# Altium project Kouspace_Ana_Aviyonik.PrjPcb
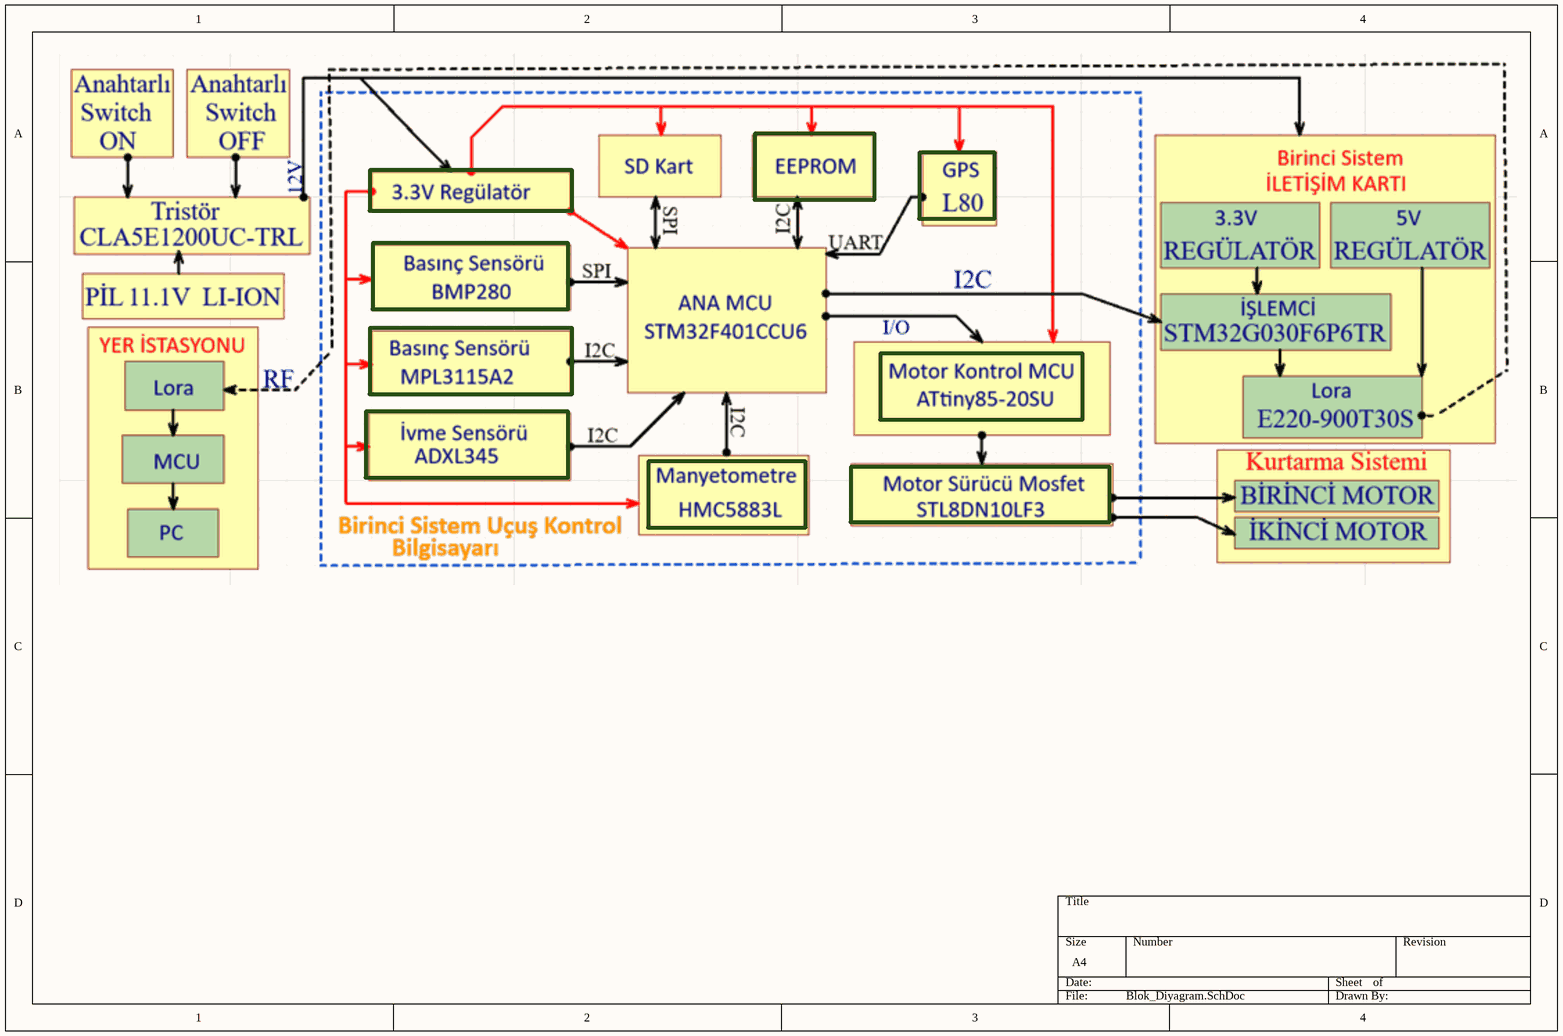
[diagram p0: Blok_Diyagram.SchDoc]
5 sheets, 85 parts. Net scope: global (net labels, ports and power ports of the same name join across sheets).
Board file: PCB.PcbDoc
Sheets:
  Blok_Diyagram.SchDoc
  Power.SchDoc
  Sensor.SchDoc
  Motor_Kontrol.SchDoc
  İşlemci.SchDoc

## Sheet Blok_Diyagram.SchDoc
size A4; SheetNumber: 1; SheetTotal: 4

## Sheet Power.SchDoc
size A4; SheetNumber: 2; SheetTotal: 4
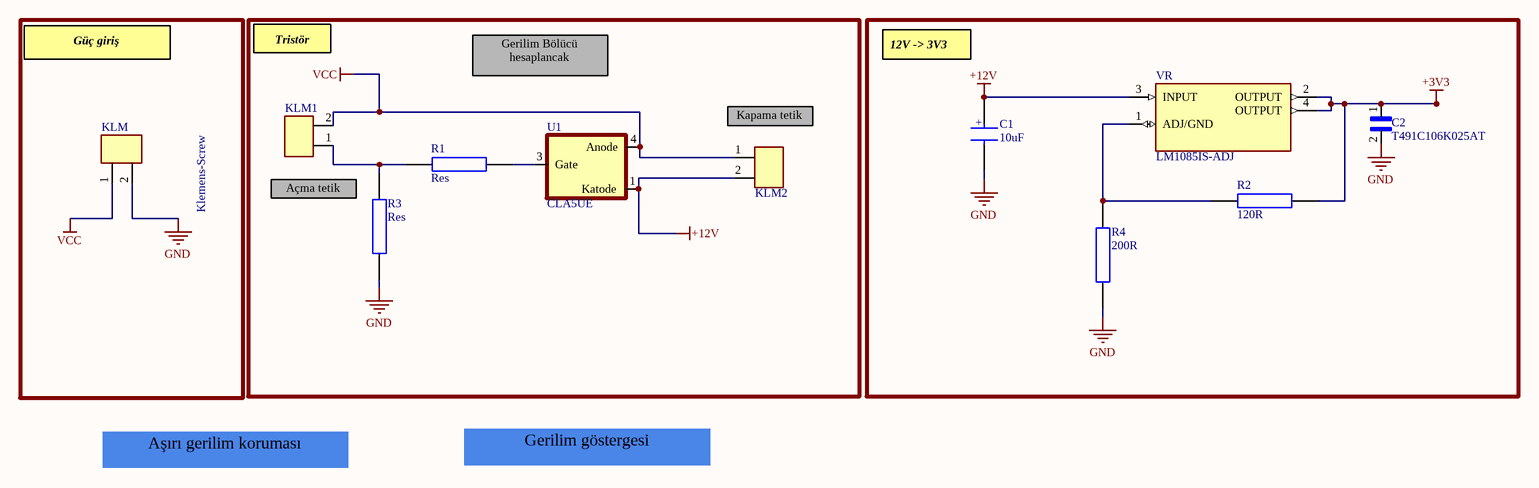
[diagram p1: Power.SchDoc]

### Parts
C1  10uF  [CAP_805]
C2  T491C106K025AT  [CAPPC6032X280N]
KLM  Klemens-Screw  [Klemens-ScrewMount]
KLM1  Klemens-Screw  [Klemens-ScrewMount]  (value not drawn)
KLM2  Klemens-Screw  [Klemens-ScrewMount]  (value not drawn)
R1  Res  [RES_1206]
R2  120R  [RES_1206]
R3  Res  [RES_1206]
R4  200R  [RES_1206]
U1  CLA5UE  [DPAK229P990X239-4N]
VR  LM1085IS-ADJ  [TO254P1524X483-4N]

### Nets
+3V3: C2.1 R2.1 VR.2(OUTPUT) VR.4(OUTPUT)
+12V: C1.1 KLM2.2 U1.1(Katode) VR.3(INPUT)
GND: C1.2 C2.2 KLM.2 R3.1 R4.1
VCC: KLM.1 KLM1.2 KLM2.1 U1.4(Anode)
NetKLM1_1: KLM1.1 R1.2 R3.2
NetR1_1: R1.1 U1.3(Gate)
NetR2_2: R2.2 R4.2 VR.1(ADJ/GND)

### Notes on the sheet
- Güç giriş
- Tristör
- Gerilim Bölücü hesaplancak
- 12V -> 3V3
- (near KLM2) Kapama tetik
- Açma tetik
- Aşırı gerilim koruması
- Gerilim göstergesi
- (in symbol CAP 1uF) +

### Library data of the parts
C1 = CAP 1uF: 0805 smd
C2 = T491C106K025AT: 10 ÂµF Molded Tantalum Capacitors 25 V 2312 (6032 Metric) 1.5Ohm; MF: KEMET; Value: *; SnapEDA_Link: https://www.snapeda.com/parts/T491C106K025AT/KEMET/view-part/?ref=snap; Purchase-URL: https://pricing.snapeda.com/search/part/T491C106K025AT/?ref=eda; Availability: In Stock; Price: None; Package: SMD-2 KEMET; Check_prices: https://www.snapeda.com/parts/T491C106K025AT/KEMET/view-part/?ref=eda; MP: T491C106K025AT
R1-R4 = RES 1K 1206
VR = LM1085IS-ADJ: 3-A, 29-V, linear voltage regulator 3-DDPAK/TO-263; MF: Texas Instruments; SnapEDA_Link: https://www.snapeda.com/parts/LM1085IS-ADJ/Texas%20Instruments/view-part/213969/?ref=snap; Price: None; MP: LM1085IS-ADJ; Availability: Unavailable; Mouser-Purchase-URL: https://snapeda.com/shop?store=Mouser&id=213969; Value: *; Arrow_Electronics-Purchase-URL: https://snapeda.com/shop?store=Arrow+Electronics&id=213969; DigiKey-Purchase-URL: https://snapeda.com/shop?store=DigiKey&id=213969; Package: TO-263-3 Texas Instruments
KLM KLM1 KLM2 = Klemens-Screw: ComponentLink1Description: New link; ComponentLink1URL: *

## Sheet Sensor.SchDoc
size A4; SheetNumber: 3; SheetTotal: 4
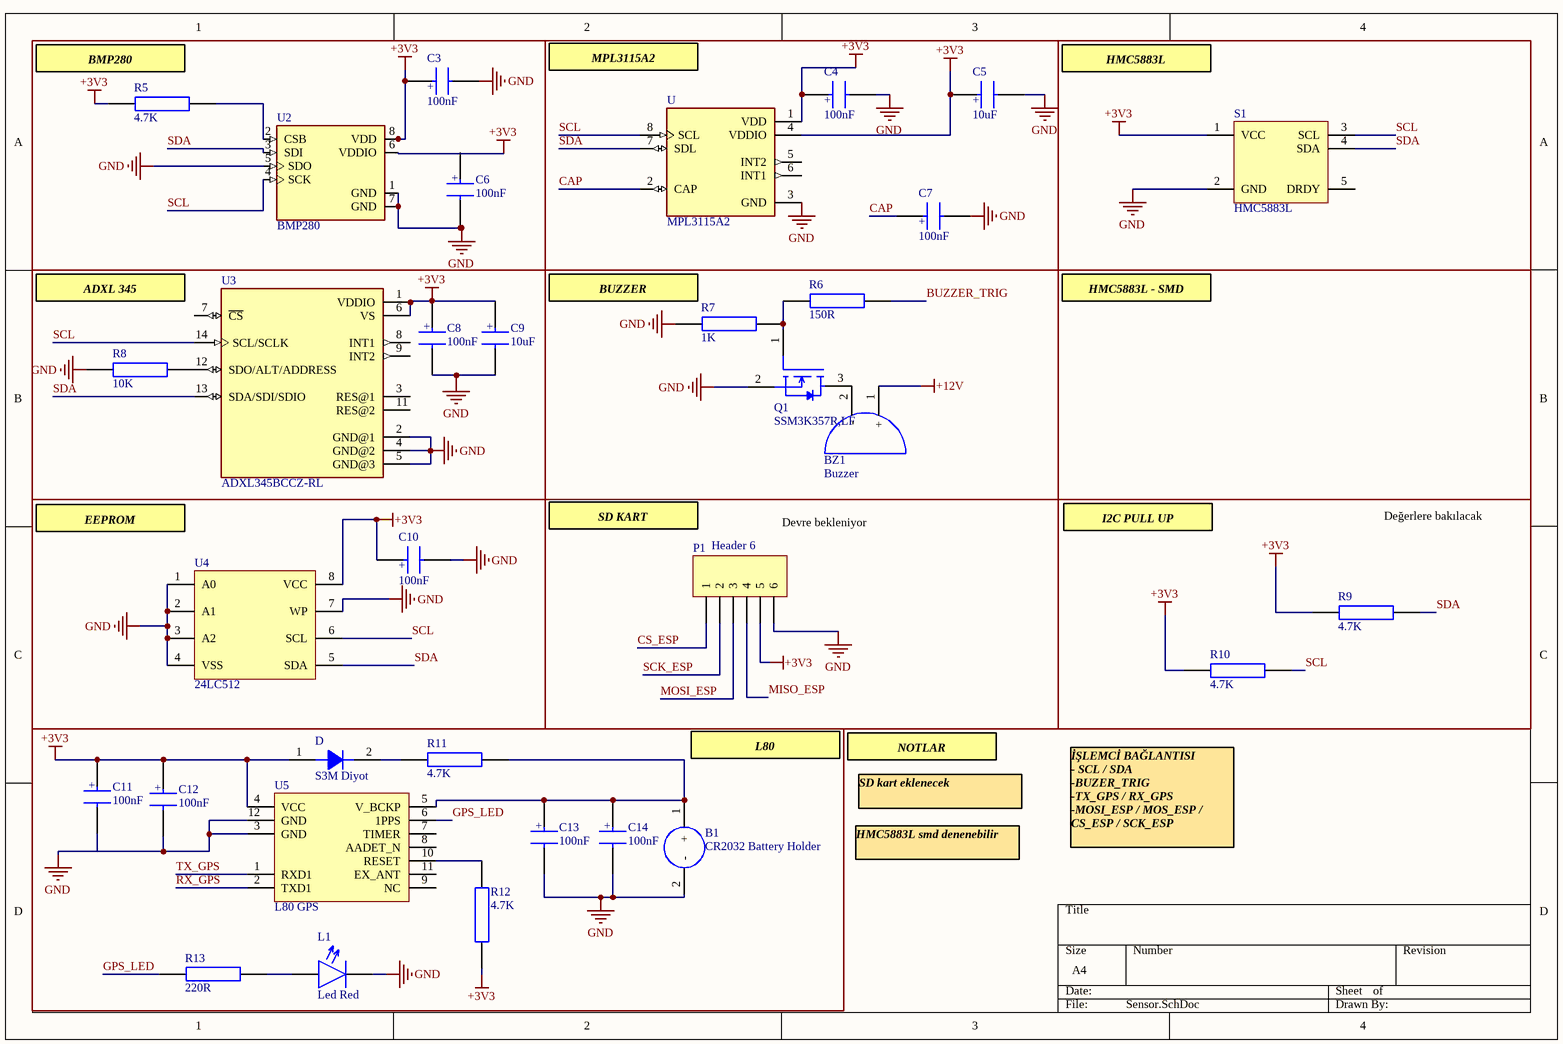
[diagram p2: Sensor.SchDoc]

### Parts
B1  CR2032 Battery Holder  [CR2032]
BZ1  Buzzer  [CMI-9605IC]
C3  100nF  [CAP_805]
C4  100nF  [CAP_805]
C5  10uF  [CAP_805]
C6  100nF  [CAP_805]
C7  100nF  [CAP_805]
C8  100nF  [CAP_805]
C9  10uF  [CAP_805]
C10  100nF  [CAP_805]
C11  100nF  [CAP_805]
C12  100nF  [CAP_805]
C13  100nF  [CAP_805]
C14  100nF  [CAP_805]
D  S3M Diyot  [DO214AA]
L1  Led Red  [Led 1206]
P1  Header 6  [HDR1X6]
Q1  SSM3K357R,LF  [SOT-23F]
R5  4.7K  [RES_1206]
R6  150R  [RES_1206]
R7  1K  [RES_1206]
R8  10K  [RES_1206]
R9  4.7K  [RES_1206]
R10  4.7K  [RES_1206]
R11  4.7K  [RES_1206]
R12  4.7K  [RES_1206]
R13  220R  [RES_1206]
S1  HMC5883L  [HMC5883L]
U  MPL3115A2  [PSON125P300X500X120-8N]
U2  BMP280  [XDCR_BMP280]
U3  ADXL345BCCZ-RL  [PQFN80P300X500X79-14N]
U4  24LC512  [soic-8]
U5  L80 GPS  [L-80]

### Nets
+3V3: C3.1 C4.1 C5.1 C8.1 C9.1 C10.1 C11.1 C12.1 D.1 P1.5 R5.1 R9.1 R10.1 R12.2 S1.1(VCC) U.1(VDD) U.4(VDDIO) U2.6(VDDIO) U2.8(VDD) U3.1(VDDIO) U3.6(VS) U4.8(VCC) U5.4(VCC)
+12V: BZ1.1(+)
GND: B1.2(-) C3.2 C4.2 C5.2 C6.2 C7.2 C8.2 C9.2 C10.2 C12.2 C13.2 C14.2 L1.2 P1.6 Q1.2(S) R7.1 R8.1 S1.2(GND) U.3(GND) U2.1(GND) U2.5(SDO) U2.7(GND) U3.2(GND@1) U3.4(GND@2) U3.5(GND@3) U4.1(A0) U4.2(A1) U4.3(A2) U4.4(VSS) U4.7(WP) U5.3(GND) U5.12(GND)
BUZZER_TRIG: R6.2
CAP: C7.1 U.2(CAP)
CS_ESP: P1.1
GPS_LED: R13.1 U5.6(1PPS)
MISO_ESP: P1.4
MOSI_ESP: P1.3
RX_GPS: U5.2(TXD1)
SCK_ESP: P1.2
SCL: R10.2 S1.3(SCL) U.8(SCL) U2.4(SCK) U3.14(SCL/SCLK) U4.6(SCL)
SDA: R9.2 S1.4(SDA) U.7(SDL) U2.3(SDI) U3.13(SDA/SDI/SDIO) U4.5(SDA)
TX_GPS: U5.1(RXD1)
NetB1_1: B1.1(+) C13.1 C14.1 R11.2 U5.5(V_BCKP)
NetBZ1_2: BZ1.2(-) Q1.3(D)
NetD_2: D.2 R11.1
NetL1_1: L1.1 R13.2
NetQ1_1: Q1.1(G) R6.1 R7.2
NetR5_2: R5.2 U2.2(CSB)
NetR8_2: R8.2 U3.12(SDO/ALT/ADDRESS)
NetR12_1: R12.1 U5.10(RESET)

Not connected (* = marked no-connect by the designer): C6 1; C11 2; S1 5(DRDY); U 5(INT2) 6(INT1); U3 3(RES@1) 7(~{CS}) 8(INT1) 9(INT2) 11(RES@2); U5 7(TIMER) 8(AADET_N) 9(NC) 11(EX_ANT)

### Notes on the sheet
- (near R5) BMP280
- (near U) MPL3115A2
- HMC5883L
- (near U3) ADXL 345
- (near R7) BUZZER
- HMC5883L - SMD
- EEPROM
- SD KART
- I2C PULL UP
- Değerlere bakılacak
- Devre bekleniyor
- L80
- NOTLAR
- HMC5883L smd denenebilir
- SD kart eklenecek
- İŞLEMCİ BAĞLANTISI
  - SCL / SDA
  -BUZER_TRIG
  -TX_GPS / RX_GPS
  -MOSI_ESP / MOS_ESP / CS_ESP / SCK_ESP
- (in symbol CAP 1uF) +

### Library data of the parts
B1 = CR2032 Battery Holder: Battery Holder
BZ1 = BUZZER: Designed by: Ahmet Azboy
C3-C14 = CAP 1uF: 0805 smd
D = S3M Diyot: Current: 3A; Voltage: 1000V; Case/Package: DO214AA
P1 = Header 6: Header, 6-Pin; LatestRevisionDate: 17-Jul-2002; LatestRevisionNote: Re-released for DXP Platform.; Publisher: Altium Limited
Q1 = SSM3K357R,LF: Trans MOSFET N-CH Si 60V 0.65A Automotive 3-Pin SOT-23F T/R; Manufacturer: Toshiba; Designed by: Ahmet Azboy; Supplier 1: Mouser; Manufacturer Part Number: SSM3K357R,LF; RoHS: No; Pricing 1: 1=0,41000, 10=0,33600, 50=0,33600, 100=0,22900, 1000=0,12900, 10000=0,10300 (USD); ComponentLink1URL: https://toshiba.semicon-storage.com/info/docget.jsp?did=59207&prodName=SSM3K357R&src-supplier=Digi-Key; ComponentLink1Description: https://toshiba.semicon-storage.com/info/docget.jsp?did=59207&prodName=SSM3K357R&src-supplier=Digi-Key; Supplier Part Number 1: 757-SSM3K357RLF; Case/Package: SOT23F
R5-R13 = RES 1K 1206
S1 = HMC5883L: Üç Eksenli Manyometre sensörü
U = MPL3115A2: Pressure Sensor 7.25PSI ~ 15.95PSI _50kPa ~ 110kPa_ Absolute 24 b 8-TLGA; MF: NXP USA; SnapEDA_Link: https://www.snapeda.com/parts/MPL3115A2/NXP%20USA%20Inc./view-part/472433/?ref=snap; Availability: Unavailable; MP: MPL3115A2; Price: None; Package: LGA-8 NXP USA; Value: *
U2 = BMP280: BMP280 Absolute Barometric Pressure Sensor for Battery Powered Devices 2 x 2.5mm; Package: None; Availability: Unavailable; MP: BMP280; Value: *; Price: None
U3 = ADXL345BCCZ-RL: Accelerometer X, Y, Z Axis Â±2g, 4g, 8g, 16g 0.05Hz ~ 1.6kHz 14-LGA (3x5); MF: Analog Devices; Check_prices: https://www.snapeda.com/parts/ADXL345BCCZ-RL/Analog%20Devices%20Inc./view-part/52306/?ref=eda; Value: *; Package: LGA -14 Analog Devices; Price: None; MP: ADXL345BCCZ-RL; Purchase-URL: https://pricing.snapeda.com/search/part/ADXL345BCCZ-RL/?ref=eda; SnapEDA_Link: https://www.snapeda.com/parts/ADXL345BCCZ-RL/Analog%20Devices%20Inc./view-part/52306/?ref=snap; Availability: Warning
U4 = 24LC512: EEPROM Serial-2Wire 512K-bit 64K x 8 3.3V/5V 8-Pin SOIJ Tube / IC EEPROM 512KBIT 400KHZ 8SOIJ; Manufacturer: Microchip; Manufacturer Part Number: 24LC512-I/SM; Access Time: 900ns; Memory Size: 512Kb; Nominal Supply Current: 5mA; Interface: I2C,Serial,2-Wire; Max Supply Voltage: 5.5V; Min Supply Voltage: 2.5V; Organization: 64KX8; Write Protection: YES; Write Cycle Time-Max (tWC): 5ms; Designed by: Ahmet Azboy; Supplier 1: RSComponents; RoHS: Yes; Category: EEPROM; Stock 1: 53; Pricing 1: 90=1,48900 (GBP); Mount: Surface Mount; Case/Package: SOIC; Number of Pins: 8; Min Operating Temperature: -40°C; Max Operating Temperature: 85°C; Packaging: Rail/Tube; Frequency: 400kHz; Density: 512Kb; Package Quantity: 90; Memory Type: EEPROM; Max Frequency: 400kHz; Access Time-Max: 900ns; Supply Current: 5mA; Programming Voltage: 5.5V; Supply Voltage-Nom: 5.5V; Length: 5.21mm; Width: 5.28mm; Height: 1.88mm; Radiation Hardening: No; Lead Free: Lead Free; RoHS Compliant: Yes; REACH SVHC: No SVHC; ComponentLink1URL: https://datasheet.ciiva.com/26870/24lc512-i-sm-26870738.pdf?src-supplier=IIIC; ComponentLink1Description: https://datasheet.ciiva.com/26870/24lc512-i-sm-26870738.pdf?src-supplier=IIIC; ComponentLink2URL: https://datasheet.ciiva.com/29294/160414-da-01-en-eeprom-24lc512-i-sm-microchip-29294348.pdf?src-supplier=Conrad; ComponentLink2Description: https://datasheet.ciiva.com/29294/160414-da-01-en-eeprom-24lc512-i-sm-microchip-29294348.pdf?src-supplier=Conrad; ComponentLink3URL: https://datasheet.ciiva.com/17651/21754m-17651369.pdf?src-supplier=Avnet+Europe; ComponentLink3Description: https://datasheet.ciiva.com/17651/21754m-17651369.pdf?src-supplier=Avnet+Europe; ComponentLink4URL: https://datasheet.ciiva.com/1155/1688094-1155274.pdf?src-supplier=Element14; ComponentLink4Description: https://datasheet.ciiva.com/1155/1688094-1155274.pdf?src-supplier=Element14; ComponentLink5URL: https://datasheet.ciiva.com/1155/1688094-1155275.pdf?src-supplier=Element14; ComponentLink5Description: https://datasheet.ciiva.com/1155/1688094-1155275.pdf?src-supplier=Element14; ComponentLink6URL: https://datasheet.ciiva.com/3184/21754m-3184956.pdf?src-supplier=Avnet; ComponentLink6Description: https://datasheet.ciiva.com/3184/21754m-3184956.pdf?src-supplier=Avnet; ComponentLink7URL: https://datasheet.ciiva.com/16921/70045251-16921949.pdf?src-supplier=Allied+Electronics; ComponentLink7Description: https://datasheet.ciiva.com/16921/70045251-16921949.pdf?src-supplier=Allied+Electronics; ComponentLink8URL: https://datasheet.ciiva.com/16304/filehandler-aspxddocname-en546203-16304574.pdf?src-supplier=Future+Electronics; ComponentLink8Description: https://datasheet.ciiva.com/16304/filehandler-aspxddocname-en546203-16304574.pdf?src-supplier=Future+Electronics; Supplier Part Number 1: 8895724
U5 = L80 GPS: Name: Quetcel L80; Designed By: Ahmet Azboy

## Sheet Motor_Kontrol.SchDoc
size A4; SheetNumber: 4; SheetTotal: 5
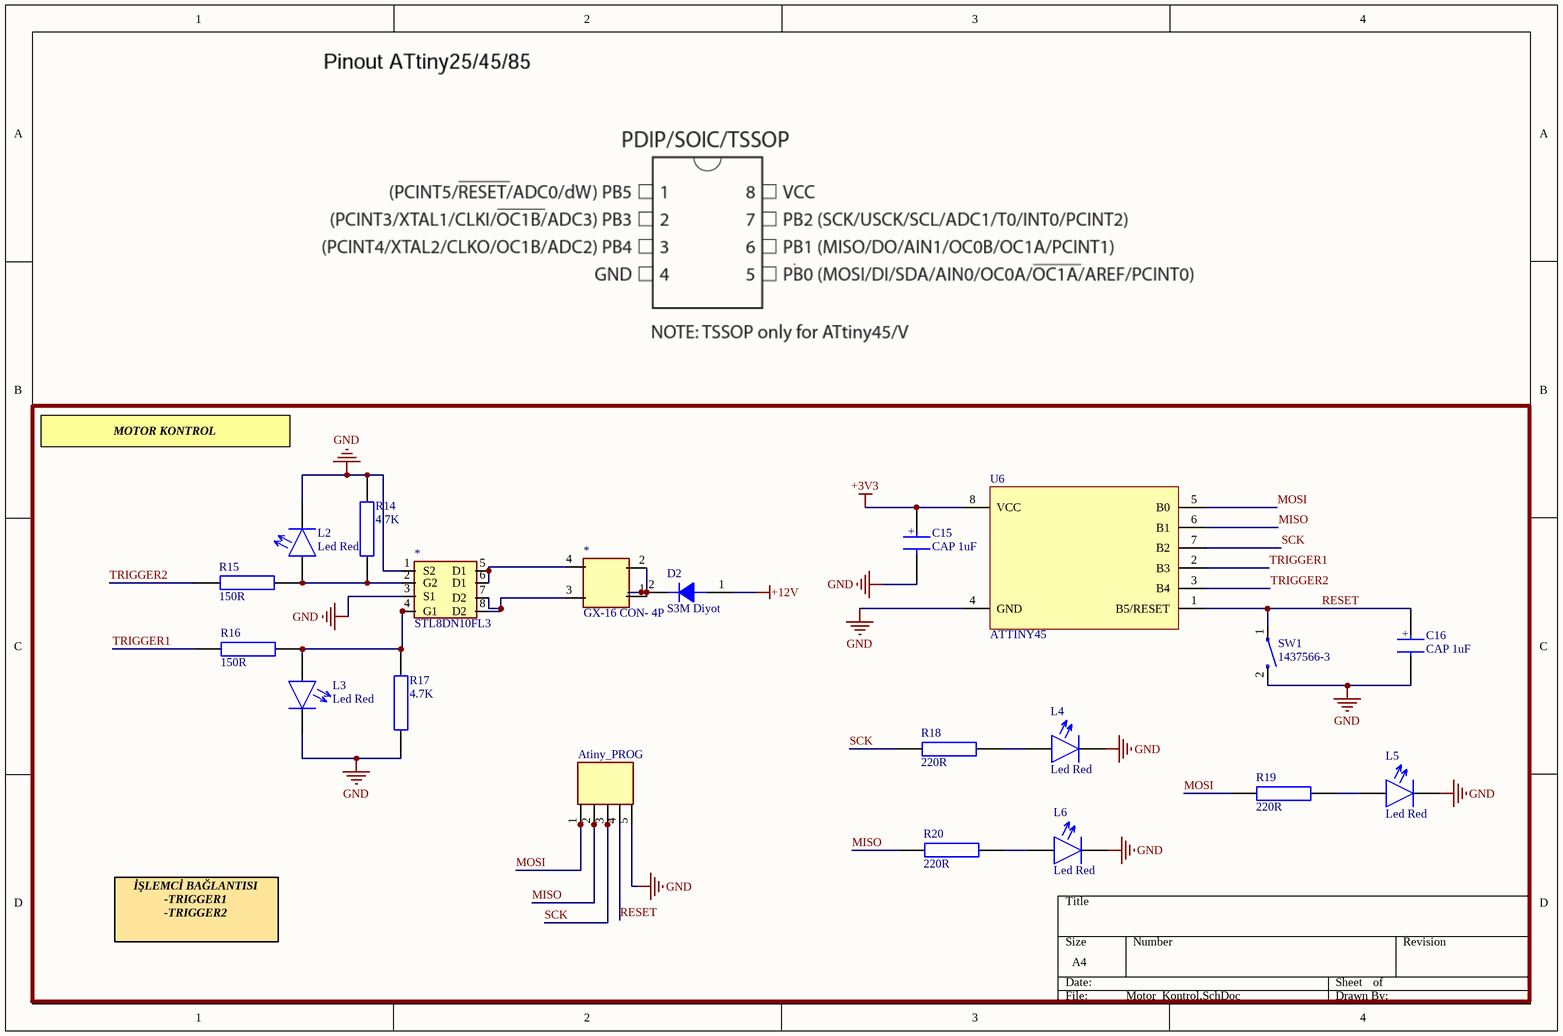
[diagram p3: Motor_Kontrol.SchDoc]

### Parts
(Parts that share a designator on the sheet are numbered #1, #2 ... from top to bottom, then left to right.)
*#1  GX-16 CON- 4P  [GX-16 CON]
*#2  STL8DN10FL3  [TRANS_STL60P4LLF6]
Atiny_PROG  SMD JST 5P  (value not drawn)
C15  CAP 1uF  [CAP_805]
C16  CAP 1uF  [CAP_805]
D2  S3M Diyot  [DO214AA]
L2  Led Red  [Led 1206]
L3  Led Red  [Led 1206]
L4  Led Red  [Led 1206]
L5  Led Red  [Led 1206]
L6  Led Red  [Led 1206]
R14  4.7K  [RES_1206]
R15  150R  [RES_1206]
R16  150R  [RES_1206]
R17  4.7K  [RES_1206]
R18  220R  [RES_1206]
R19  220R  [RES_1206]
R20  220R  [RES_1206]
SW1  1437566-3  [SW_1437566-3]
U6  ATTINY45  [soic-8]

### Nets
+3V3: C15.1 U6.8(VCC)
+12V: D2.1
GND: *#2.1(S2) *#2.3(S1) Atiny_PROG.5 C15.2 C16.2 L2.2 L3.2 L4.2 L5.2 L6.2 R14.2 R17.1 SW1.2 U6.4(GND)
MISO: Atiny_PROG.2 R20.2 U6.6(B1)
MOSI: Atiny_PROG.1 R19.2 U6.5(B0)
RESET: Atiny_PROG.4 C16.1 SW1.1 U6.1(B5/RESET)
SCK: Atiny_PROG.3 R18.2 U6.7(B2)
TRIGGER1: R16.1 U6.2(B3)
TRIGGER2: R15.1 U6.3(B4)
Net*#1_1: *#1.1 *#1.2 D2.2
Net*#1_3: *#1.3 *#2.7(D2) *#2.8(D2)
Net*#1_4: *#1.4 *#2.5(D1) *#2.6(D1)
Net*#2_2: *#2.2(G2) L2.1 R14.1 R15.2
Net*#2_4: *#2.4(G1) L3.1 R16.2 R17.2
NetL4_1: L4.1 R18.1
NetL5_1: L5.1 R19.1
NetL6_1: L6.1 R20.1

### Notes on the sheet
- MOTOR KONTROL
- İŞLEMCİ BAĞLANTISI
  -TRIGGER1
  -TRIGGER2
- (in symbol CAP 1uF) +

### Library data of the parts
C15 C16 = CAP 1uF: 0805 smd
D2 = S3M Diyot: Current: 3A; Voltage: 1000V; Case/Package: DO214AA
R14-R20 = RES 1K 1206
SW1 = 1437566-3: Switch Tactile OFF (ON) SPST Rectangular Button Gull Wing 0.05A 12VDC SMD Loose Piece; Price: None; Value: *; Package: None; Availability: Unavailable; MP: 1437566-3
U6 = ATTINY45: ATtiny Series 4 KB Flash 256 B SRAM 20 MHz 8-Bit Microcontroller - SOIC-8; Manufacturer: Microchip / Atmel; Manufacturer Part Number: ATTINY45-20SU; Frequency: 20MHz; Oscillator Type: Internal; Memory Size: 4KB; Peripherals: Brown-out Detect/Reset,POR,PWM,WDT; Number of I/Os: 6; Core Architecture: AVR; Max Supply Voltage: 5.5V; Min Supply Voltage: 2.7V; Data Bus Width: 8b; RAM Size: 256B; Watchdog Timer: Yes; Number of Timers/Counters: 2; Interface: SPI; Number of ADC Channels: 4; Number of SPI Channels: 1; Access Time: 20us; Supplier 1: Newark; RoHS: Yes; Category: Microcontrollers; Mount: Surface Mount; Case/Package: SOIC; Number of Pins: 8; Contact Plating: Tin,Matte; Min Operating Temperature: -40°C; Max Operating Temperature: 85°C; Memory Type: FLASH; Packaging: Rail/Tube; Package Quantity: 95; Max Frequency: 20MHz; Number of Programmable I/O: 6; Number of PWM Channels: 6; Number of I2C Channels: 1; Number of UART Channels: 1; Termination: SMD/SMT; Address Bus Width: 8b; Length: 5.35mm; Width: 5.4mm; Height: 1.91mm; Radiation Hardening: No; Lead Free: Lead Free; REACH SVHC: No SVHC; ComponentLink1URL: https://datasheet.ciiva.com/15122/getdatasheetpartid-123040-15122445.pdf?src-supplier=Verical; ComponentLink1Description: https://datasheet.ciiva.com/15122/getdatasheetpartid-123040-15122445.pdf?src-supplier=Verical; ComponentLink2URL: https://datasheet.ciiva.com/28653/1738893-28653749.pdf?src-supplier=Element14; ComponentLink2Description: https://datasheet.ciiva.com/28653/1738893-28653749.pdf?src-supplier=Element14; ComponentLink3URL: https://datasheet.ciiva.com/3203/doc2586-3203982.pdf?src-supplier=Avnet; ComponentLink3Description: https://datasheet.ciiva.com/3203/doc2586-3203982.pdf?src-supplier=Avnet; ComponentLink4URL: https://datasheet.ciiva.com/26207/doc2586-26207534.pdf?src-supplier=Avnet+Europe; ComponentLink4Description: https://datasheet.ciiva.com/26207/doc2586-26207534.pdf?src-supplier=Avnet+Europe; Supplier Part Number 1: 68T3731

## Sheet İşlemci.SchDoc
size A4; SheetNumber: 5; SheetTotal: 5
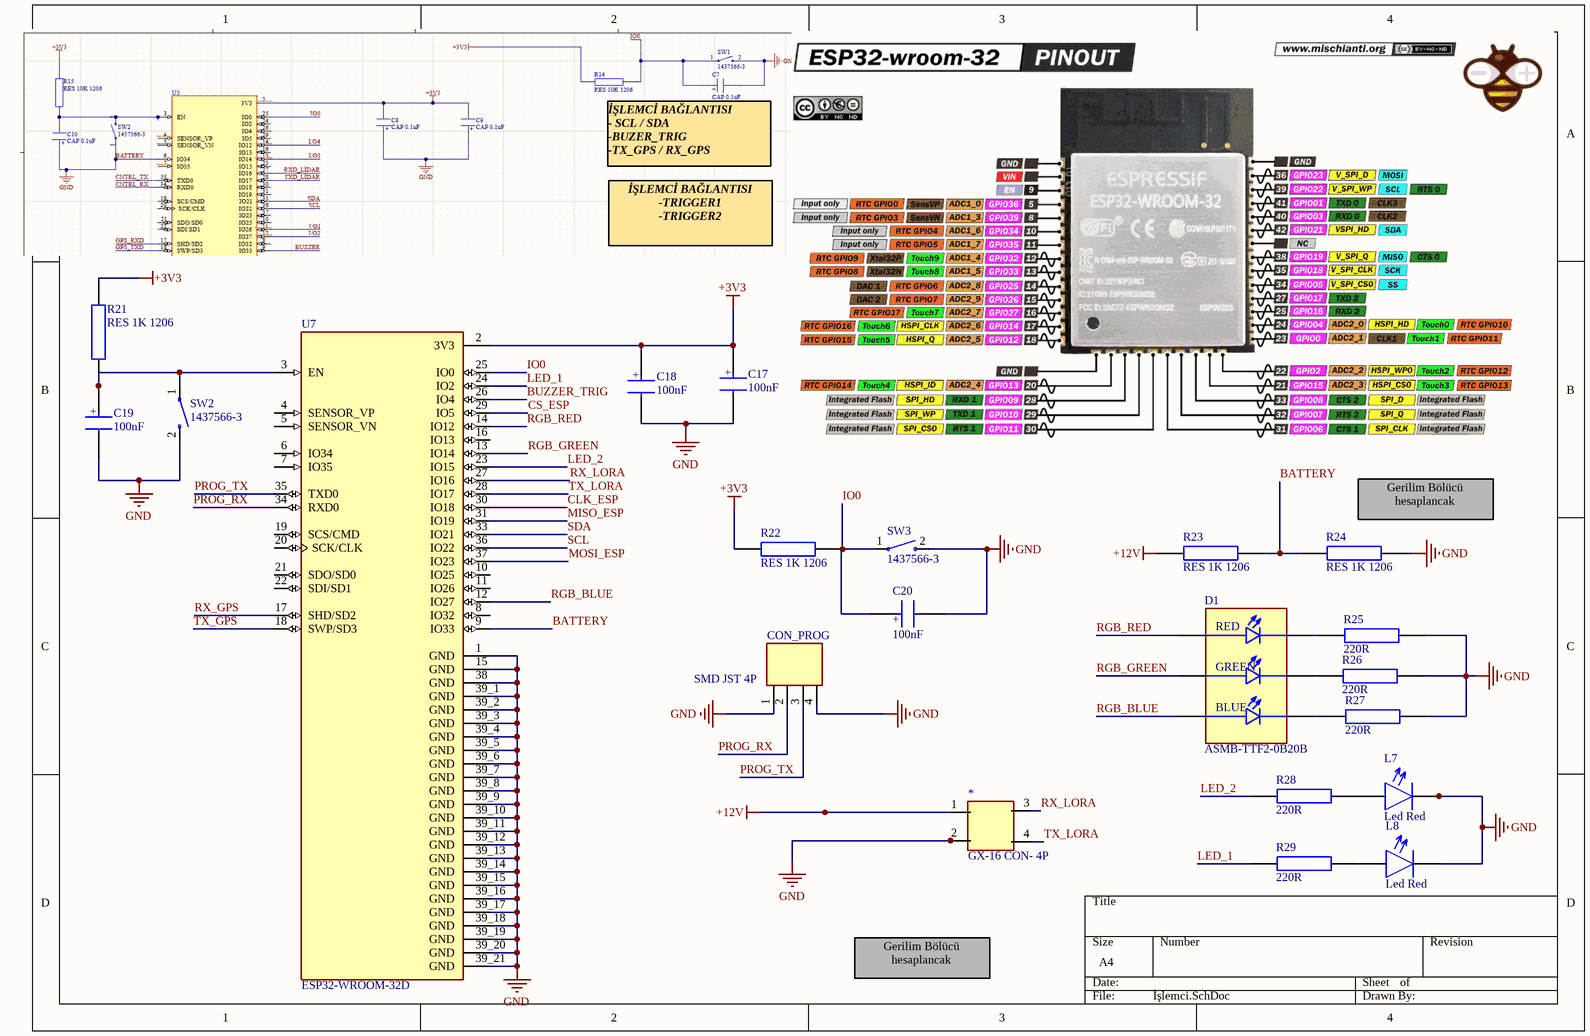
[diagram p4: İşlemci.SchDoc]

### Parts
(Parts that share a designator on the sheet are numbered #1, #2 ... from top to bottom, then left to right.)
*#3  GX-16 CON- 4P  [GX-16 CON]
C17  100nF  [CAP_805]
C18  100nF  [CAP_805]
C19  100nF  [CAP_805]
C20  100nF  [CAP_805]
CON_PROG  SMD JST 4P  [L-KLS1-XL1-4P]
D1  ASMB-TTF2-0B20B  [LED_ASMB-TTF2-0B20B]
L7  Led Red  [Led 1206]
L8  Led Red  [Led 1206]
R21  RES 1K 1206  [RES_1206]
R22  RES 1K 1206  [RES_1206]
R23  RES 1K 1206  [RES_1206]
R24  RES 1K 1206  [RES_1206]
R25  220R  [RES_1206]
R26  220R  [RES_1206]
R27  220R  [RES_1206]
R28  220R  [RES_1206]
R29  220R  [RES_1206]
SW2  1437566-3  [SW_1437566-3]
SW3  1437566-3  [SW_1437566-3]
U7  ESP32-WROOM-32D  [MODULE_ESP32-WROOM-32D]

### Nets
+3V3: C17.1 C18.1 R21.2 R22.2 U7.2(3V3)
+12V: *#3.1 R23.1
GND: *#3.2 C17.2 C18.2 C19.2 C20.2 CON_PROG.1 CON_PROG.4 L7.2 L8.2 R24.2 R25.1 R26.1 R27.1 SW2.2 SW3.2 U7.1(GND) U7.15(GND) U7.38(GND) U7.39_1(GND) U7.39_2(GND) U7.39_3(GND) U7.39_4(GND) U7.39_5(GND) U7.39_6(GND) U7.39_7(GND) U7.39_8(GND) U7.39_9(GND) U7.39_10(GND) U7.39_11(GND) U7.39_12(GND) U7.39_13(GND) U7.39_14(GND) U7.39_15(GND) U7.39_16(GND) U7.39_17(GND) U7.39_18(GND) U7.39_19(GND) U7.39_20(GND) U7.39_21(GND)
BATTERY: R23.2 R24.1 U7.9(IO33)
BUZZER_TRIG: U7.26(IO4)
CLK_ESP: U7.30(IO18)
CS_ESP: U7.29(IO5)
IO0: C20.1 R22.1 SW3.1 U7.25(IO0)
LED_1: R29.2 U7.24(IO2)
LED_2: R28.2 U7.23(IO15)
MISO_ESP: U7.31(IO19)
MOSI_ESP: U7.37(IO23)
PROG_RX: CON_PROG.2 U7.34(RXD0)
PROG_TX: CON_PROG.3 U7.35(TXD0)
RGB_BLUE: D1.5(B_A) U7.12(IO27)
RGB_GREEN: D1.3(G_A) U7.13(IO14)
RGB_RED: D1.1(R_A) U7.14(IO12)
RX_GPS: U7.17(SHD/SD2)
RX_LORA: *#3.3 U7.27(IO16)
SCL: U7.36(IO22)
SDA: U7.33(IO21)
TX_GPS: U7.18(SWP/SD3)
TX_LORA: *#3.4 U7.28(IO17)
NetC19_1: C19.1 R21.1 SW2.1 U7.3(EN)
NetD1_2: D1.2(R_C) R25.2
NetD1_4: D1.4(G_C) R26.2
NetD1_6: D1.6(B_C) R27.2
NetL7_1: L7.1 R28.1
NetL8_1: L8.1 R29.1

Not connected (* = marked no-connect by the designer): U7 4(SENSOR_VP) 5(SENSOR_VN) 6(IO34) 7(IO35) 8(IO32) 10(IO25) 11(IO26) 16(IO13) 19(SCS/CMD) 20(SCK/CLK) 21(SDO/SD0) 22(SDI/SD1)

### Notes on the sheet
- İŞLEMCİ BAĞLANTISI
  - SCL / SDA
  -BUZER_TRIG
  -TX_GPS / RX_GPS
- İŞLEMCİ BAĞLANTISI
  -TRIGGER1
  -TRIGGER2
- (near R24) Gerilim Bölücü hesaplancak
- Gerilim Bölücü hesaplancak
- (in symbol ASMB-TTF2-0B20B) RED; GREEN; BLUE
- (in symbol CAP 1uF) +

### Library data of the parts
C17-C20 = CAP 1uF: 0805 smd
D1 = ASMB-TTF2-0B20B: LED RGB DIFFUSED 6PLCC SMD; MF: Broadcom / Avago; Purchase-URL: https://pricing.snapeda.com/search/part/ASMB-TTF2-0B20B/?ref=eda; Value: *; Availability: In Stock; Package: None; Check_prices: https://www.snapeda.com/parts/ASMB-TTF2-0B20B/Avago/view-part/?ref=eda; SnapEDA_Link: https://www.snapeda.com/parts/ASMB-TTF2-0B20B/Avago/view-part/?ref=snap; MP: ASMB-TTF2-0B20B; Price: None
R25-R29 = RES 1K 1206
SW2 SW3 = 1437566-3: as SW1 on sheet Motor_Kontrol; Price: None; Value: *; Package: None; Availability: Unavailable; MP: 1437566-3
U7 = ESP32-WROOM-32D: Bluetooth, WiFi 802.11b/g/n, Bluetooth v4.2 +EDR, Class 1, 2 and 3 Transceiver Module 2.4GHz ~ 2.5GHz Integrated; MF: Espressif Systems; Price: None; Availability: In Stock; Package: Module Espressif Systems; MP: ESP32-WROOM-32D; Value: *; SnapEDA_Link: https://www.snapeda.com/parts/ESP32-WROOM-32D/Espressif+Systems/view-part/?ref=snap; Purchase-URL: https://pricing.snapeda.com/search/part/ESP32-WROOM-32D/?ref=eda; Check_prices: https://www.snapeda.com/parts/ESP32-WROOM-32D/Espressif+Systems/view-part/?ref=eda

## Nets that join several sheets
+3V3: Power (C2.1 R2.1 VR.2 VR.4), Sensor (23 pins), Motor_Kontrol (C15.1 U6.8), İşlemci (5 pins)
+12V: Power (C1.1 KLM2.2 U1.1 VR.3), Sensor (BZ1.1), Motor_Kontrol (D2.1), İşlemci (*#3.1 R23.1)
GND: Power (5 pins), Sensor (32 pins), Motor_Kontrol (14 pins), İşlemci (39 pins)
BUZZER_TRIG: Sensor (R6.2), İşlemci (U7.26)
CS_ESP: Sensor (P1.1), İşlemci (U7.29)
MISO_ESP: Sensor (P1.4), İşlemci (U7.31)
MOSI_ESP: Sensor (P1.3), İşlemci (U7.37)
RX_GPS: Sensor (U5.2), İşlemci (U7.17)
SCL: Sensor (6 pins), İşlemci (U7.36)
SDA: Sensor (6 pins), İşlemci (U7.33)
TX_GPS: Sensor (U5.1), İşlemci (U7.18)